# Altium project CtrlBoxV2.PrjPcb
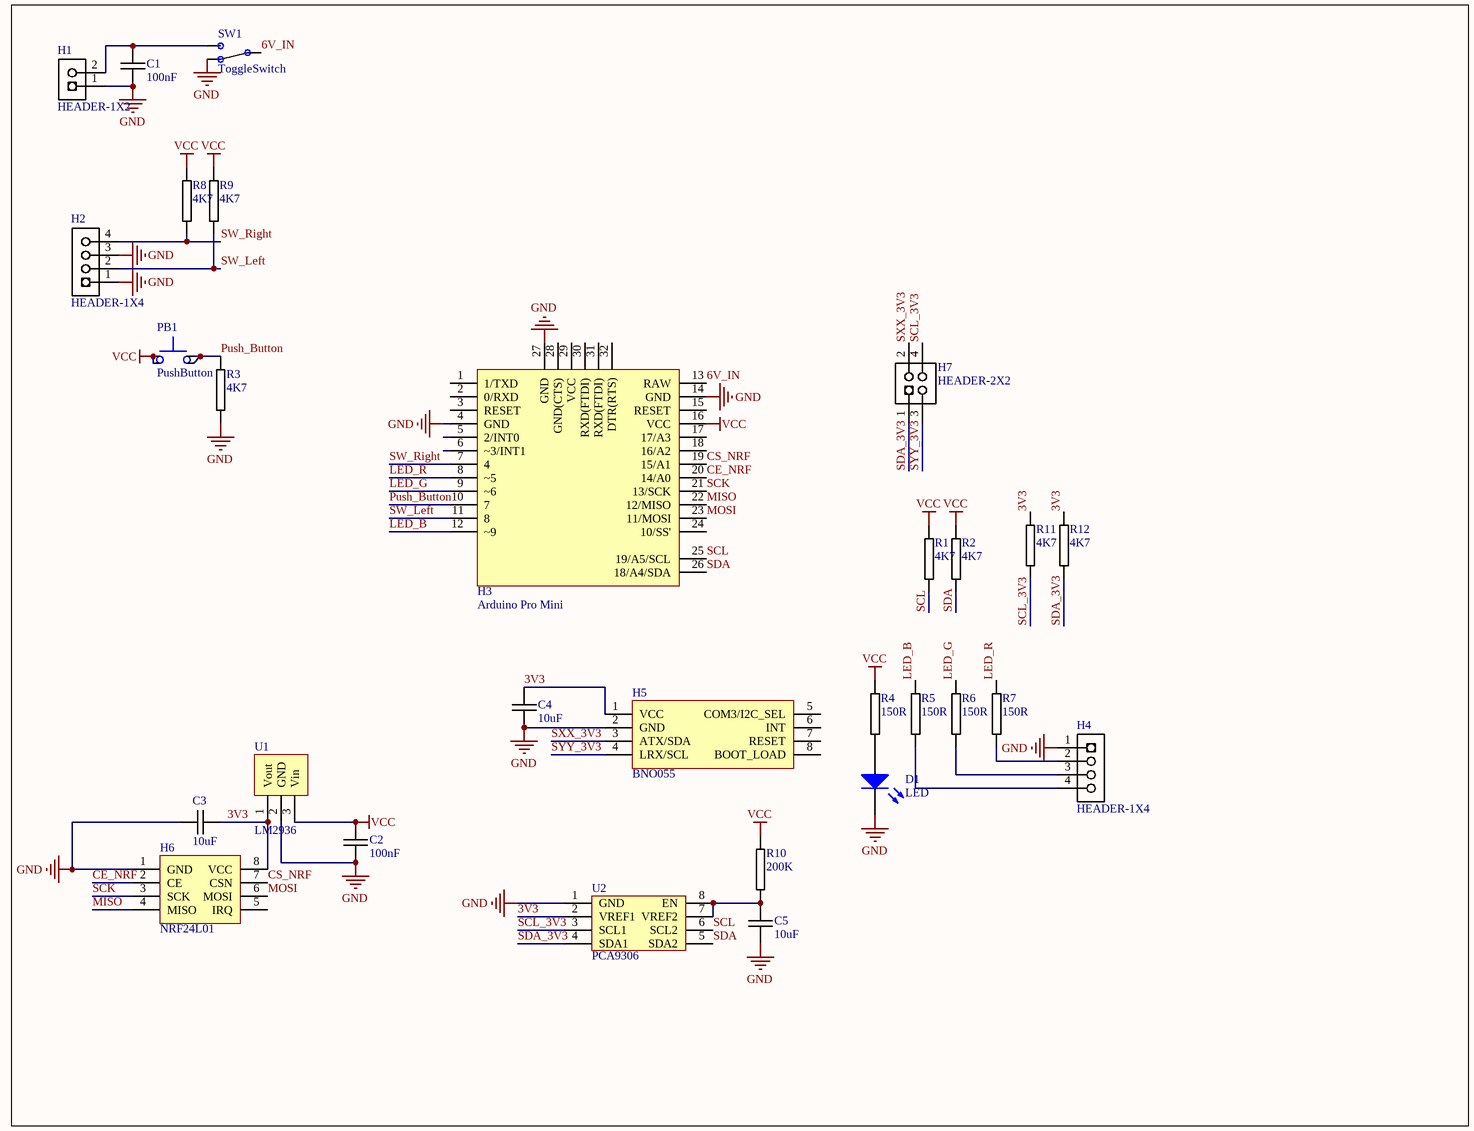
[diagram p0: CtrlBoxV2.SchDoc]
1 sheet, 29 parts. Net scope: global (net labels, ports and power ports of the same name join across sheets).
Board file: CtrlBoxV2.PcbDoc

## Sheet CtrlBoxV2.SchDoc
size 274 x 210 mm

### Parts
C1  100nF  [0805C-TBD]
C2  100nF  [0805C-TBD]
C3  10uF  [0805C-GENERIC]
C4  10uF  [0805C-GENERIC]
C5  10uF  [0805C-GENERIC]
D1  LED  [LED]
H1  HEADER-1X2  [HEADER-1X2]
H2  HEADER-1X4  [HEADER-1X4]
H3  Arduino Pro Mini  [Arduino Pro Mini]
H4  HEADER-1X4  [HEADER-1X4]
H5  BNO055  [BNO055]
H6  NRF24L01  [NRF24L01]
H7  HEADER-2X2  [HEADER-2X2]
PB1  PushButton  [PushButton]
R1  4K7  [0805R-4K7]
R2  4K7  [0805R-4K7]
R3  4K7  [0805R-4K7]
R4  150R  [0805R-150]
R5  150R  [0805R-150]
R6  150R  [0805R-150]
R7  150R  [0805R-150]
R8  4K7  [0805R-4K7]
R9  4K7  [0805R-4K7]
R10  200K  [0805R-4K7]
R11  4K7  [0805R-4K7]
R12  4K7  [0805R-4K7]
SW1  ToggleSwitch  [SWITCHFOOTPRINT]
U1  LM2936  [LM2936]
U2  PCA9306  [PCA9306]

### Nets
GND: C1.1 C2.2 C3.1 C4.2 C5.2 D1.2(K) H1.1 H2.1 H2.3 H3.4(GND) H3.14(GND) H3.27(GND) H4.1 H5.2(GND) H6.1(GND) R3.2 SW1.24 U1.2(GND) U2.1(GND)
VCC: C2.1 H3.16(VCC) PB1.26 PB1.28 R1.1 R2.1 R4.1 R8.1 R9.1 R10.2 U1.3(Vin)
3V3: C3.2 C4.1 H5.1(VCC) H6.8(VCC) R11.1 R12.1 U1.1(Vout) U2.2(VREF1)
6V_IN: H3.13(RAW) SW1.23
CE_NRF: H3.20(14/A0) H6.2(CE)
CS_NRF: H3.19(15/A1) H6.7(CSN)
LED_B: H3.12(~9) R5.1
LED_G: H3.9(~6) R6.1
LED_R: H3.8(~5) R7.1
MISO: H3.22(12/MISO) H6.4(MISO)
MOSI: H3.23(11/MOSI) H6.6(MOSI)
Push_Button: H3.10(7) PB1.27 PB1.29 R3.1
SCK: H3.21(13/SCK) H6.3(SCK)
SCL: H3.25(19/A5/SCL) R1.2 U2.6(SCL2)
SCL_3V3: H7.4 R11.2 U2.3(SCL1)
SDA: H3.26(18/A4/SDA) R2.2 U2.5(SDA2)
SDA_3V3: H7.1 R12.2 U2.4(SDA1)
SW_Left: H2.2 H3.11(8) R9.2
SW_Right: H2.4 H3.7(4) R8.2
SXX_3V3: H5.3(ATX/SDA) H7.2
SYY_3V3: H5.4(LRX/SCL) H7.3
NetC1_2: C1.2 H1.2 SW1.25
NetC5_1: C5.1 R10.1 U2.7(VREF2) U2.8(EN)
NetD1_1: D1.1(A) R4.2
NetH4_2: H4.2 R7.2
NetH4_3: H4.3 R6.2
NetH4_4: H4.4 R5.2

Not connected (* = marked no-connect by the designer): H3 1(1/TXD) 2(0/RXD) 3(RESET) 5(2/INT0) 6(~3/INT1) 15(RESET) 17(17/A3) 18(16/A2) 24(10/SS') 28(GND(CTS)) 29(VCC) 30(RXD(FTDI)) 31(RXD(FTDI)) 32(DTR(RTS)); H5 5(COM3/I2C_SEL) 6(INT) 7(RESET) 8(BOOT_LOAD); H6 5(IRQ)

### Library data of the parts
C1 C2 = 0805C-100nF-25V-X7R-MUR: CAPACITOR 0805 CERAMIC; Supplier 1: Digi-Key; Supplier Part Number 1: 490-1673-1-ND
C3-C5 = 0805C-10UF-16V-X5R-TDK: CAPACITOR 0805 CERAMIC; Manufacturer Part Number: C2012X5R1C106M; Manufacturer: TDK Corporation; REEL: C63; Supplier 1: Digi-Key; Supplier Part Number 1: 445-4115-2-ND
D1 = LED: Small LED
H1 = HEADER-1X2: REEL: TH; Supplier 1: Digi-Key; Supplier Part Number 1: S1011E-36-ND
H5 = BNO055: Accel+Gyro+Mag
H6 = NRF24L01: Radio Transceiver
PB1 = PushButton: pin to pad: 26>5 27>7 28>6 29>8
R1-R3 R8-R12 = 0805R-4K7: RESISTOR 0805 1/4 WATT THIN FILM; Reel: *
R4-R7 = 0805R-150: RESISTOR 0805 1/4 WATT THIN FILM; Reel: *
SW1 = ToggleSwitch: pin to pad: 23>3 24>2 25>4
U1 = LM2936: 3V3 Voltage Regulator
U2 = PCA9306: Dual Bidirectional I2C Voltage Level Translator
H2 H4 = HEADER-1X4: Supplier 1: Digi-Key; Supplier Part Number 1: S1011E-36-ND